# EAGLE design mkstepper23 (EAGLE 9.0.0)
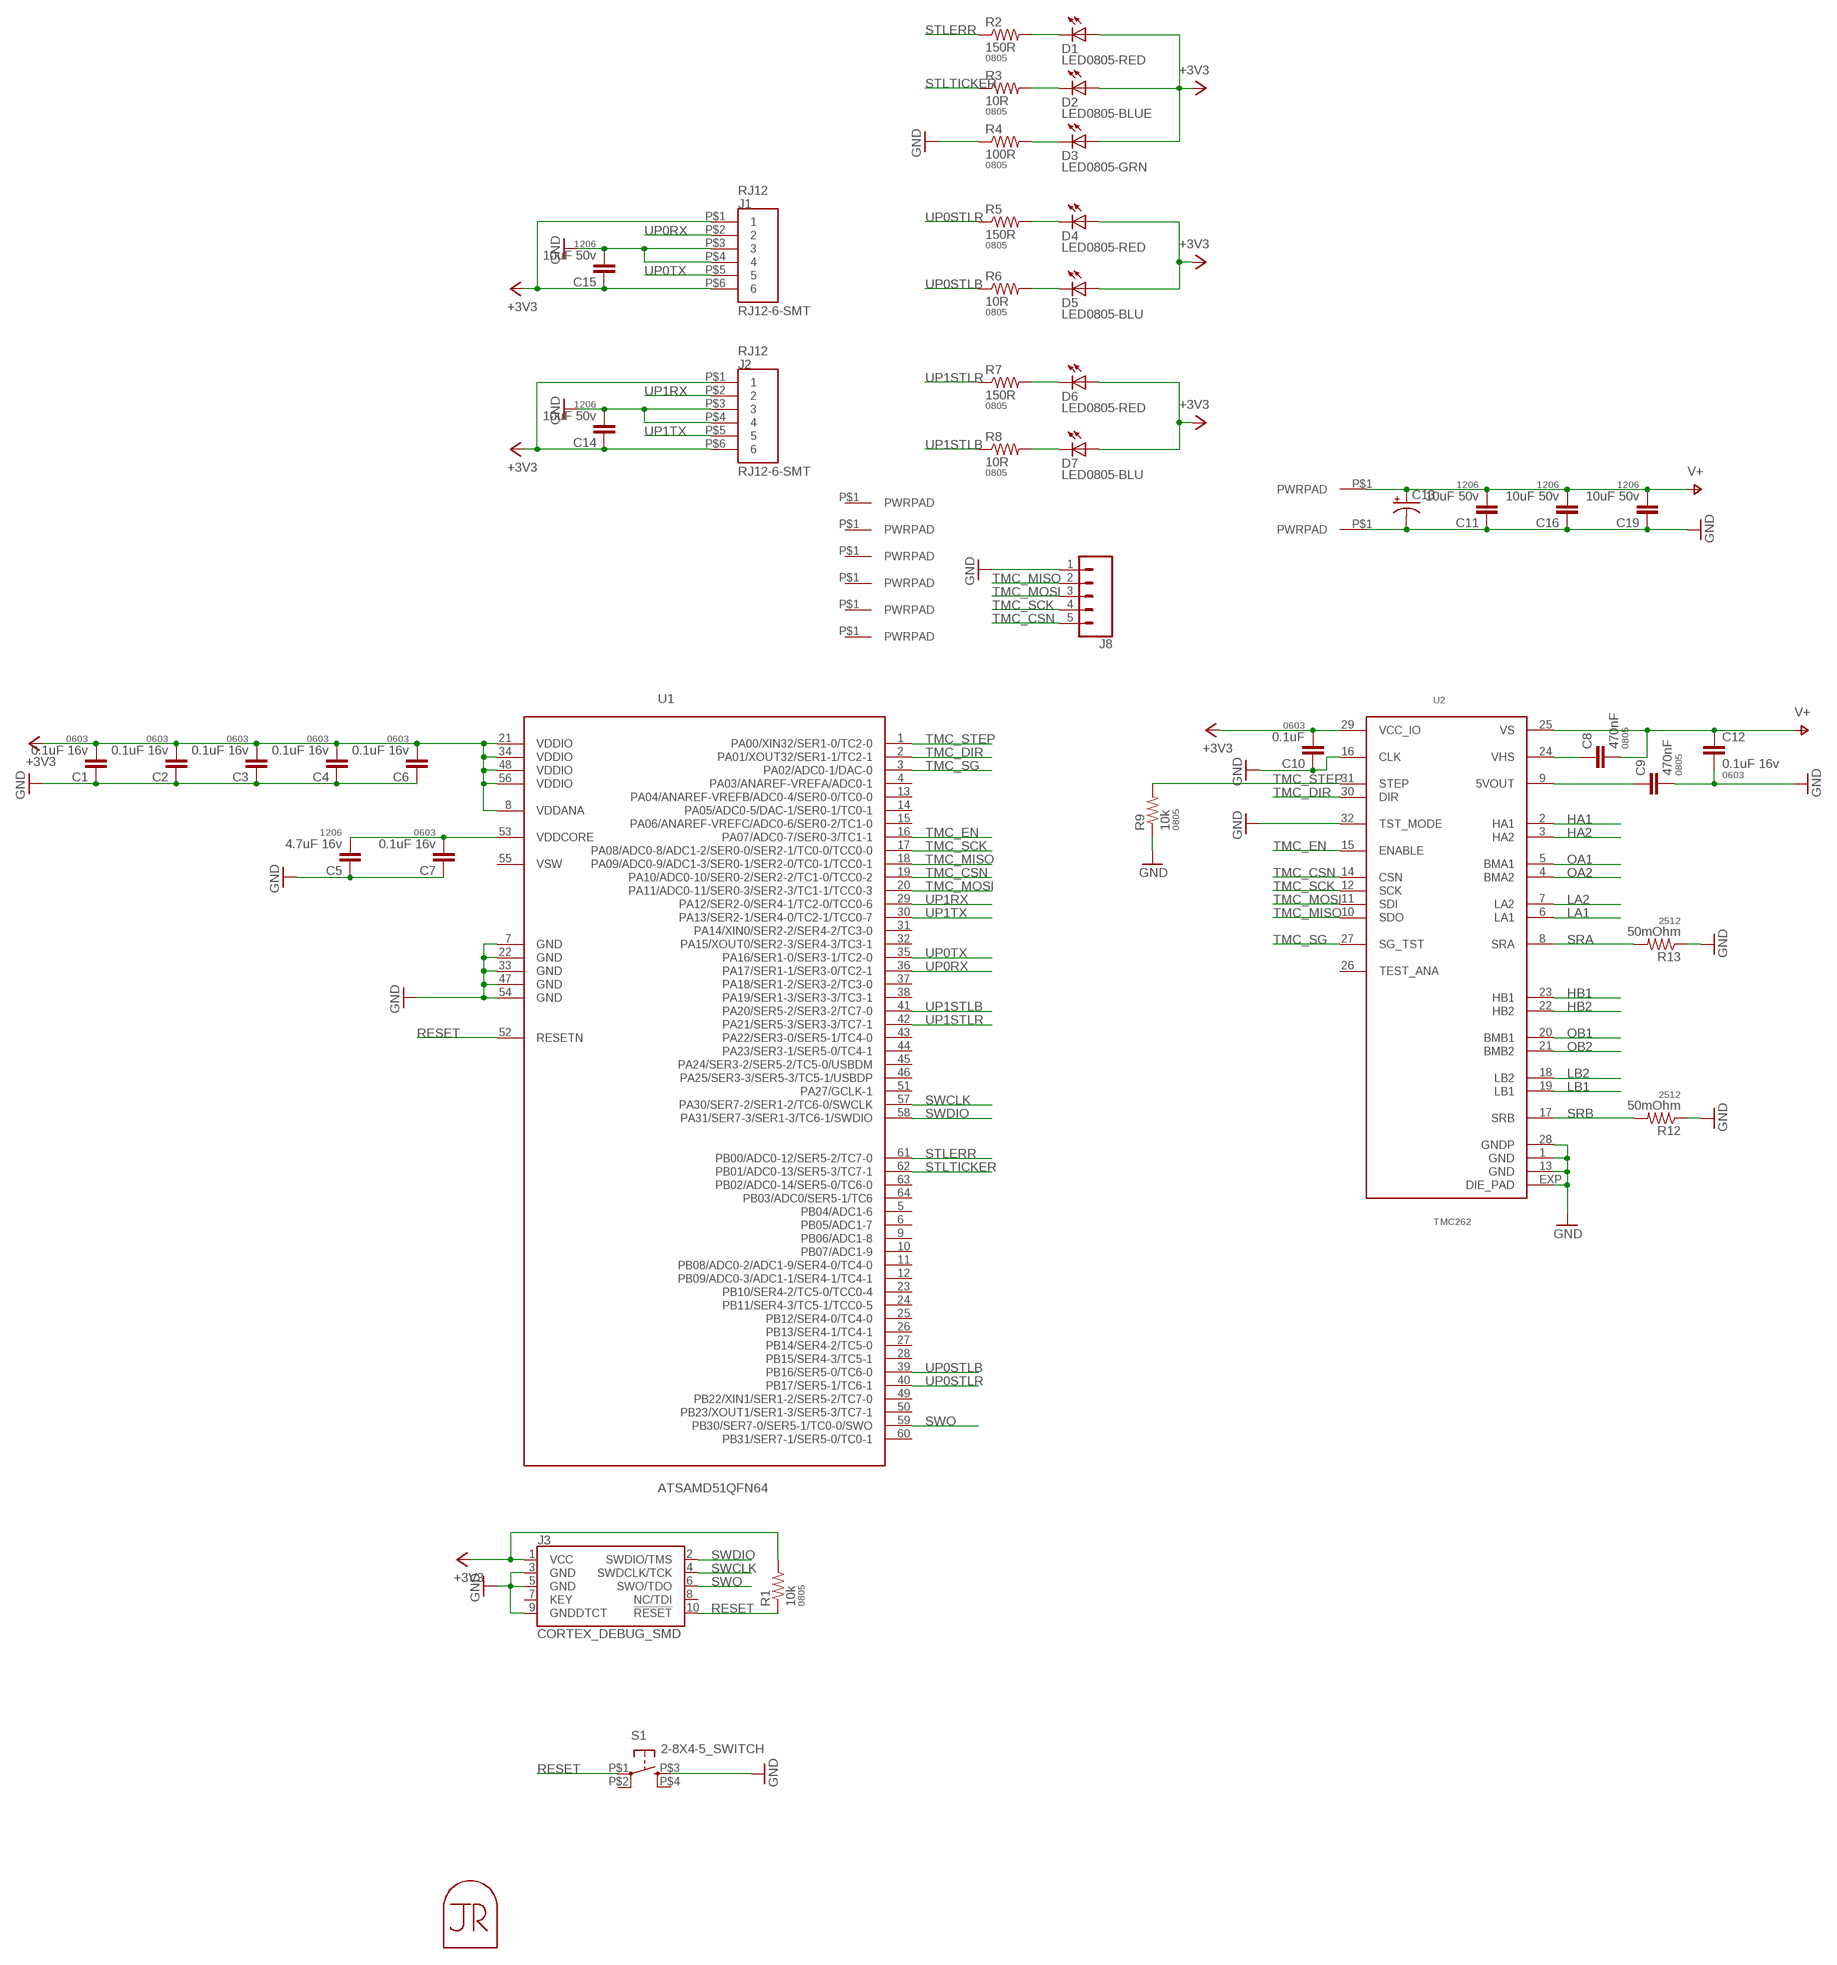
[diagram p0: schematic, sheet 1, part 1 of 2]
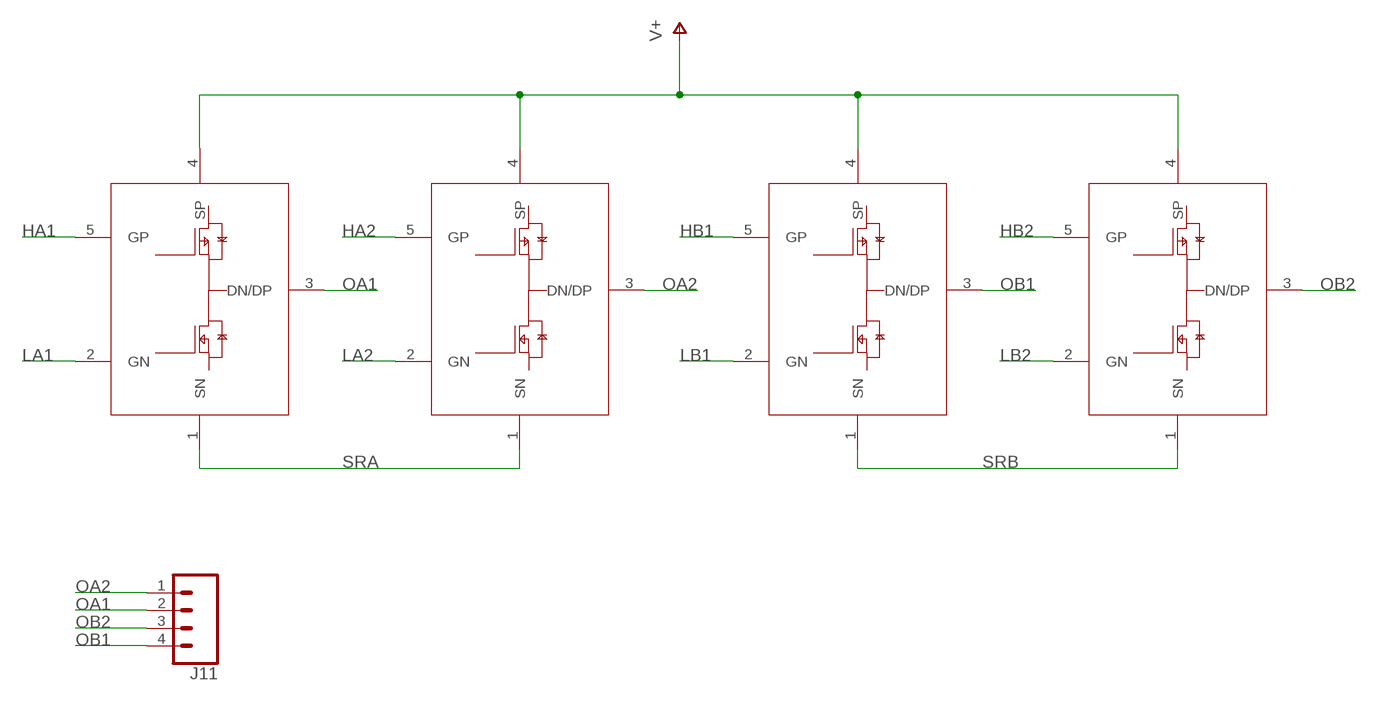
[diagram p1: schematic, sheet 1, part 2 of 2]

## Parts
C1  0.1uF 16v  CAP0603-CAP  [0603-CAP]
C2  0.1uF 16v  CAP0603-CAP  [0603-CAP]
C3  0.1uF 16v  CAP0603-CAP  [0603-CAP]
C4  0.1uF 16v  CAP0603-CAP  [0603-CAP]
C5  4.7uF 16v  CAP1206  [1206]
C6  0.1uF 16v  CAP0603-CAP  [0603-CAP]
C7  0.1uF 16v  CAP0603-CAP  [0603-CAP]
C8  470nF  CAP0805  [0805]
C9  470nF  CAP0805  [0805]
C10  0.1uF  CAP0603-CAP  [0603-CAP]
C11  10uF 50v  CAP1206  [1206]
C12  0.1uF 16v  CAP0603-CAP  [0603-CAP]
C13  CAP-POL-6.6X6.6  [6.6X6.6-CAP]
C14  10uF 50v  CAP1206  [1206]
C15  10uF 50v  CAP1206  [1206]
C16  10uF 50v  CAP1206  [1206]
C19  10uF 50v  CAP1206  [1206]
D1  LED0805-RED  LED0805  [LED0805]
D2  LED0805-BLUE  LED0805  [LED0805]
D3  LED0805-GRN  LED0805  [LED0805]
D4  LED0805-RED  LED0805  [LED0805]
D5  LED0805-BLU  LED0805  [LED0805]
D6  LED0805-RED  LED0805  [LED0805]
D7  LED0805-BLU  LED0805  [LED0805]
J1  RJ12-6-SMT  [RJ12-6-SMT]
J2  RJ12-6-SMT  [RJ12-6-SMT]
J3  CORTEX_DEBUG_SMD  [SAMTECH_FTSH-105-01]
J4  PWRPADM3-SKINNY  [PWRPAD_3-25MM-SKINNY]
J5  PWRPADM3-SKINNY  [PWRPAD_3-25MM-SKINNY]
J6  PWRPADM3-SKINNY  [PWRPAD_3-25MM-SKINNY]
J7  PWRPADM3-SKINNY  [PWRPAD_3-25MM-SKINNY]
J8  CONN_05NO_SILK  [1X05_NO_SILK]
J9  PWRPAD  [PWRPAD_M3-PEM-MOUNT]
J10  PWRPAD  [PWRPAD_M3-PEM-MOUNT]
J11  CONN_04LONGPADS  [1X04_LONGPADS]
J12  PWRPADM3-SKINNY  [PWRPAD_3-25MM-SKINNY]
J13  PWRPADM3-SKINNY  [PWRPAD_3-25MM-SKINNY]
MP1  JRTOMBSTONE  [JRTOMBSTONE]
Q1  PNPAIR-FDD8424H  [DPAK-5]
Q2  PNPAIR-FDD8424H  [DPAK-5]
Q3  PNPAIR-FDD8424H  [DPAK-5]
Q4  PNPAIR-FDD8424H  [DPAK-5]
R1  10k  RESISTOR0805-RES  [0805]
R2  150R  RESISTOR0805-RES  [0805]
R3  10R  RESISTOR0805-RES  [0805]
R4  100R  RESISTOR0805-RES  [0805]
R5  150R  RESISTOR0805-RES  [0805]
R6  10R  RESISTOR0805-RES  [0805]
R7  150R  RESISTOR0805-RES  [0805]
R8  10R  RESISTOR0805-RES  [0805]
R9  10k  RESISTOR0805-RES  [0805]
R12  50mOhm  RESISTOR2512  [R2512]
R13  50mOhm  RESISTOR2512  [R2512]
S1  2-8X4-5_SWITCH  [TACT-SWITCH-KMR6]
U1  ATSAMD51QFN64  [QFN-64-9X9MM]
U2  TMC262  [QFN32]

## Nets
+3V3: C1.2 C2.2 C3.2 C4.2 C6.2 C10.2 C14.1 C15.1 D1.1(A) D2.1(A) D3.1(A) D4.1(A) D5.1(A) D6.1(A) D7.1(A) J1.P$1 J1.P$6 J2.P$1 J2.P$6 J3.1(VCC) R1.2 U1.8(VDDANA) U1.21(VDDIO) U1.34(VDDIO) U1.48(VDDIO) U1.56(VDDIO) U2.29(VCC_IO)
GND: C1.1 C2.1 C3.1 C4.1 C5.1 C6.1 C7.1 C9.2 C10.1 C11.1 C12.2 C13.- C14.2 C15.2 C16.1 C19.1 J1.P$3 J1.P$4 J2.P$3 J2.P$4 J3.3(GND) J3.5(GND) J3.9(GNDDTCT) J8.1 J10.P$1(PWRPAD) R4.1 R9.1 R12.1 R13.1 S1.P$3(S) U1.7(GND) U1.22(GND) U1.33(GND) U1.47(GND) U1.54(GND) U2.1(GND) U2.13(GND) U2.16(CLK) U2.28(GNDP) U2.32(TST_MODE) U2.EXP(DIE_PAD)
HA1: Q1.5(GP) U2.2(HA1)
HA2: Q2.5(GP) U2.3(HA2)
HB1: Q3.5(GP) U2.23(HB1)
HB2: Q4.5(GP) U2.22(HB2)
LA1: Q1.2(GN) U2.6(LA1)
LA2: Q2.2(GN) U2.7(LA2)
LB1: Q3.2(GN) U2.19(LB1)
LB2: Q4.2(GN) U2.18(LB2)
N$1: D3.2(C) R4.2
N$2: C8.1 U2.24(VHS)
N$3: C9.1 U2.9(5VOUT)
N$5: D2.2(C) R3.2
N$6: D1.2(C) R2.2
N$7: C5.2 C7.2 U1.53(VDDCORE)
N$10: D4.2(C) R5.2
N$11: D5.2(C) R6.2
N$13: D6.2(C) R7.2
N$14: D7.2(C) R8.2
OA1: J11.2 Q1.3(DN/DP) U2.5(BMA1)
OA2: J11.1 Q2.3(DN/DP) U2.4(BMA2)
OB1: J11.4 Q3.3(DN/DP) U2.20(BMB1)
OB2: J11.3 Q4.3(DN/DP) U2.21(BMB2)
RESET: J3.10(!RESET) R1.1 S1.P$1(P) U1.52(RESETN)
SRA: Q1.1(SN) Q2.1(SN) R13.2 U2.8(SRA)
SRB: Q3.1(SN) Q4.1(SN) R12.2 U2.17(SRB)
STLERR: R2.1 U1.61(PB00/ADC0-12/SER5-2/TC7-0)
STLTICKER: R3.1 U1.62(PB01/ADC0-13/SER5-3/TC7-1)
SWCLK: J3.4(SWDCLK/TCK) U1.57(PA30/SER7-2/SER1-2/TC6-0/SWCLK)
SWDIO: J3.2(SWDIO/TMS) U1.58(PA31/SER7-3/SER1-3/TC6-1/SWDIO)
SWO: J3.6(SWO/TDO) U1.59(PB30/SER7-0/SER5-1/TC0-0/SWO)
TMC_CSN: J8.5 U1.19(PA10/ADC0-10/SER0-2/SER2-2/TC1-0/TCC0-2) U2.14(CSN)
TMC_DIR: U1.2(PA01/XOUT32/SER1-1/TC2-1) U2.30(DIR)
TMC_EN: U1.16(PA07/ADC0-7/SER0-3/TC1-1) U2.15(ENABLE)
TMC_MISO: J8.2 U1.18(PA09/ADC0-9/ADC1-3/SER0-1/SER2-0/TC0-1/TCC0-1) U2.10(SDO)
TMC_MOSI: J8.3 U1.20(PA11/ADC0-11/SER0-3/SER2-3/TC1-1/TCC0-3) U2.11(SDI)
TMC_SCK: J8.4 U1.17(PA08/ADC0-8/ADC1-2/SER0-0/SER2-1/TC0-0/TCC0-0) U2.12(SCK)
TMC_SG: U1.3(PA02/ADC0-1/DAC-0) U2.27(SG_TST)
TMC_STEP: R9.2 U1.1(PA00/XIN32/SER1-0/TC2-0) U2.31(STEP)
UP0RX: J1.P$2 U1.36(PA17/SER1-1/SER3-0/TC2-1)
UP0STLB: R6.1 U1.39(PB16/SER5-0/TC6-0)
UP0STLR: R5.1 U1.40(PB17/SER5-1/TC6-1)
UP0TX: J1.P$5 U1.35(PA16/SER1-0/SER3-1/TC2-0)
UP1RX: J2.P$2 U1.29(PA12/SER2-0/SER4-1/TC2-0/TCC0-6)
UP1STLB: R8.1 U1.41(PA20/SER5-2/SER3-2/TC7-0)
UP1STLR: R7.1 U1.42(PA21/SER5-3/SER3-3/TC7-1)
UP1TX: J2.P$5 U1.30(PA13/SER2-1/SER4-0/TC2-1/TCC0-7)
V+: C8.2 C11.2 C12.1 C13.+ C16.2 C19.2 J9.P$1(PWRPAD) Q1.4(SP) Q2.4(SP) Q3.4(SP) Q4.4(SP) U2.25(VS)
Unconnected: J3.7(KEY) J3.8(NC/TDI) J4.P$1(PWRPAD) J5.P$1(PWRPAD) J6.P$1(PWRPAD) J7.P$1(PWRPAD) J12.P$1(PWRPAD) J13.P$1(PWRPAD) S1.P$2(P1) S1.P$4(S1) U1.4(PA03/ANAREF-VREFA/ADC0-1) U1.5(PB04/ADC1-6) U1.6(PB05/ADC1-7) U1.9(PB06/ADC1-8) U1.10(PB07/ADC1-9) U1.11(PB08/ADC0-2/ADC1-9/SER4-0/TC4-0) U1.12(PB09/ADC0-3/ADC1-1/SER4-1/TC4-1) U1.13(PA04/ANAREF-VREFB/ADC0-4/SER0-0/TC0-0) U1.14(PA05/ADC0-5/DAC-1/SER0-1/TC0-1) U1.15(PA06/ANAREF-VREFC/ADC0-6/SER0-2/TC1-0) U1.23(PB10/SER4-2/TC5-0/TCC0-4) U1.24(PB11/SER4-3/TC5-1/TCC0-5) U1.25(PB12/SER4-0/TC4-0) U1.26(PB13/SER4-1/TC4-1) U1.27(PB14/SER4-2/TC5-0) U1.28(PB15/SER4-3/TC5-1) U1.31(PA14/XIN0/SER2-2/SER4-2/TC3-0) U1.32(PA15/XOUT0/SER2-3/SER4-3/TC3-1) U1.37(PA18/SER1-2/SER3-2/TC3-0) U1.38(PA19/SER1-3/SER3-3/TC3-1) U1.43(PA22/SER3-0/SER5-1/TC4-0) U1.44(PA23/SER3-1/SER5-0/TC4-1) U1.45(PA24/SER3-2/SER5-2/TC5-0/USBDM) U1.46(PA25/SER3-3/SER5-3/TC5-1/USBDP) U1.49(PB22/XIN1/SER1-2/SER5-2/TC7-0) U1.50(PB23/XOUT1/SER1-3/SER5-3/TC7-1) U1.51(PA27/GCLK-1) U1.55(VSW) U1.60(PB31/SER7-1/SER5-0/TC0-1) U1.63(PB02/ADC0-14/SER5-0/TC6-0) U1.64(PB03/ADC0/SER5-1/TC6) U2.26(TEST_ANA)

## Library data of the parts
C1-C4 C6 C7 C10 C12 = borkedlabs-passives:CAP: Capacitor Standard 0603 ceramic capacitor, and 0.1" leaded capacitor.; PACKAGE: 0603
C5 C11 C14-C16 C19 = borkedlabs-passives:CAP: Capacitor Standard 0603 ceramic capacitor, and 0.1" leaded capacitor.; PACKAGE: 1206
C8 C9 = borkedlabs-passives:CAP: Capacitor Standard 0603 ceramic capacitor, and 0.1" leaded capacitor.; PACKAGE: 0805
C13 = borkedlabs-passives:CAP-POL
D1-D7 = lights:LED: LED
J1 J2 = connector:RJ12-6-SMT
J3 = SparkFun-Connectors:CORTEX_DEBUG: Cortex Debug Connector - 10 pin Supports JTAG debug, Serial Wire debug, and Serial Wire Viewer. PTH and SMD connector options available. General Connector Information <http://infocenter.arm.com/help/topic/com.arm.doc.faqs/attached/13634/cortex_debug_connectors.pdf> Products: PTH Connector <http://www.digikey.com/product-detail/en/cnc-tech/3220-10-0100-00/1175-1627-ND/3883661> -via Digi-Key SparkFun PSoc <https://www.sparkfun.com/products/13229> SparkFun T <https://www.sparkfun.com/products/13810>
J4-J7 J9 J10 J12 J13 = power:PWRPAD
J8 = SparkFun-Connectors:CONN_05: Multi connection point. Often used as Generic Header-pin footprint for 0.1 inch spaced/style header connections On any of the 0.1 inch spaced packages, you can populate with these: Break Away Headers - Straight <https://www.sparkfun.com/products/116> (PRT-00116) Break Away Male Headers - Right Angle <https://www.sparkfun.com/products/553> (PRT-00553) Female Headers <https://www.sparkfun.com/products/115> (PRT-00115) Break Away Headers - Machine Pin <https://www.sparkfun.com/products/117> (PRT-00117) Break Away Female Headers - Swiss Machine Pin <https://www.sparkfun.com/products/743> (PRT-00743) For SCREWTERMINALS and SPRING TERMINALS visit here: Screw Terimnals on SparkFun.com <https://www.sparkfun.com/search/results?term=Screw+Terminals> (5mm/3.5mm/2.54mm spacing) This device is also useful as a general connection point to wire up your design to another part of your project. Our various solder wires solder well into these plated through hole pads. Hook-Up Wire - Assortment (Stranded, 22 AWG) <https://www.sparkfun.com/products/11375> (PRT-11375) Hook-Up Wire - Assortment (Solid Core, 22 AWG) <https://www.sparkfun.com/products/11367> (PRT-11367) View the entire wire category on our website here <https://www.sparkfun.com/categories/141> Special notes: Molex polarized connector foot print use with SKU : PRT-08231 with associated crimp pins and housings. 1MM SMD Version SKU: PRT-10208
J11 = SparkFun-Connectors:CONN_04: Multi connection point. Often used as Generic Header-pin footprint for 0.1 inch spaced/style header connections On any of the 0.1 inch spaced packages, you can populate with these: Break Away Headers - Straight <https://www.sparkfun.com/products/116> (PRT-00116) Break Away Male Headers - Right Angle <https://www.sparkfun.com/products/553> (PRT-00553) Female Headers <https://www.sparkfun.com/products/115> (PRT-00115) Break Away Headers - Machine Pin <https://www.sparkfun.com/products/117> (PRT-00117) Break Away Female Headers - Swiss Machine Pin <https://www.sparkfun.com/products/743> (PRT-00743) For SCREWTERMINALS and SPRING TERMINALS visit here: Screw Terimnals on SparkFun.com <https://www.sparkfun.com/search/results?term=Screw+Terminals> (5mm/3.5mm/2.54mm spacing) This device is also useful as a general connection point to wire up your design to another part of your project. Our various solder wires solder well into these plated through hole pads. Hook-Up Wire - Assortment (Stranded, 22 AWG) <https://www.sparkfun.com/products/11375> (PRT-11375) Hook-Up Wire - Assortment (Solid Core, 22 AWG) <https://www.sparkfun.com/products/11367> (PRT-11367) View the entire wire category on our website here <https://www.sparkfun.com/categories/141> Special notes: Molex polarized connector foot print use with SKU : PRT-08231 with associated crimp pins and housings. 1MM SMD Version SKU: PRT-10208; PROD_ID: CONN-09696
MP1 = connector:JRTOMBSTONE
Q1-Q4 = power:PNPAIR-FDD8424H
R1-R9 = borkedlabs-passives:RESISTOR: Resistor Basic schematic elements and footprints for 0603, 1206, and PTH resistors.; PACKAGE: 0805
R12 R13 = borkedlabs-passives:RESISTOR: Resistor Basic schematic elements and footprints for 0603, 1206, and PTH resistors.; PACKAGE: 2512
S1 = fab:2-8X4-5_SWITCH
U1 = atsam:ATSAMD51
U2 = power:TMC262

## Board
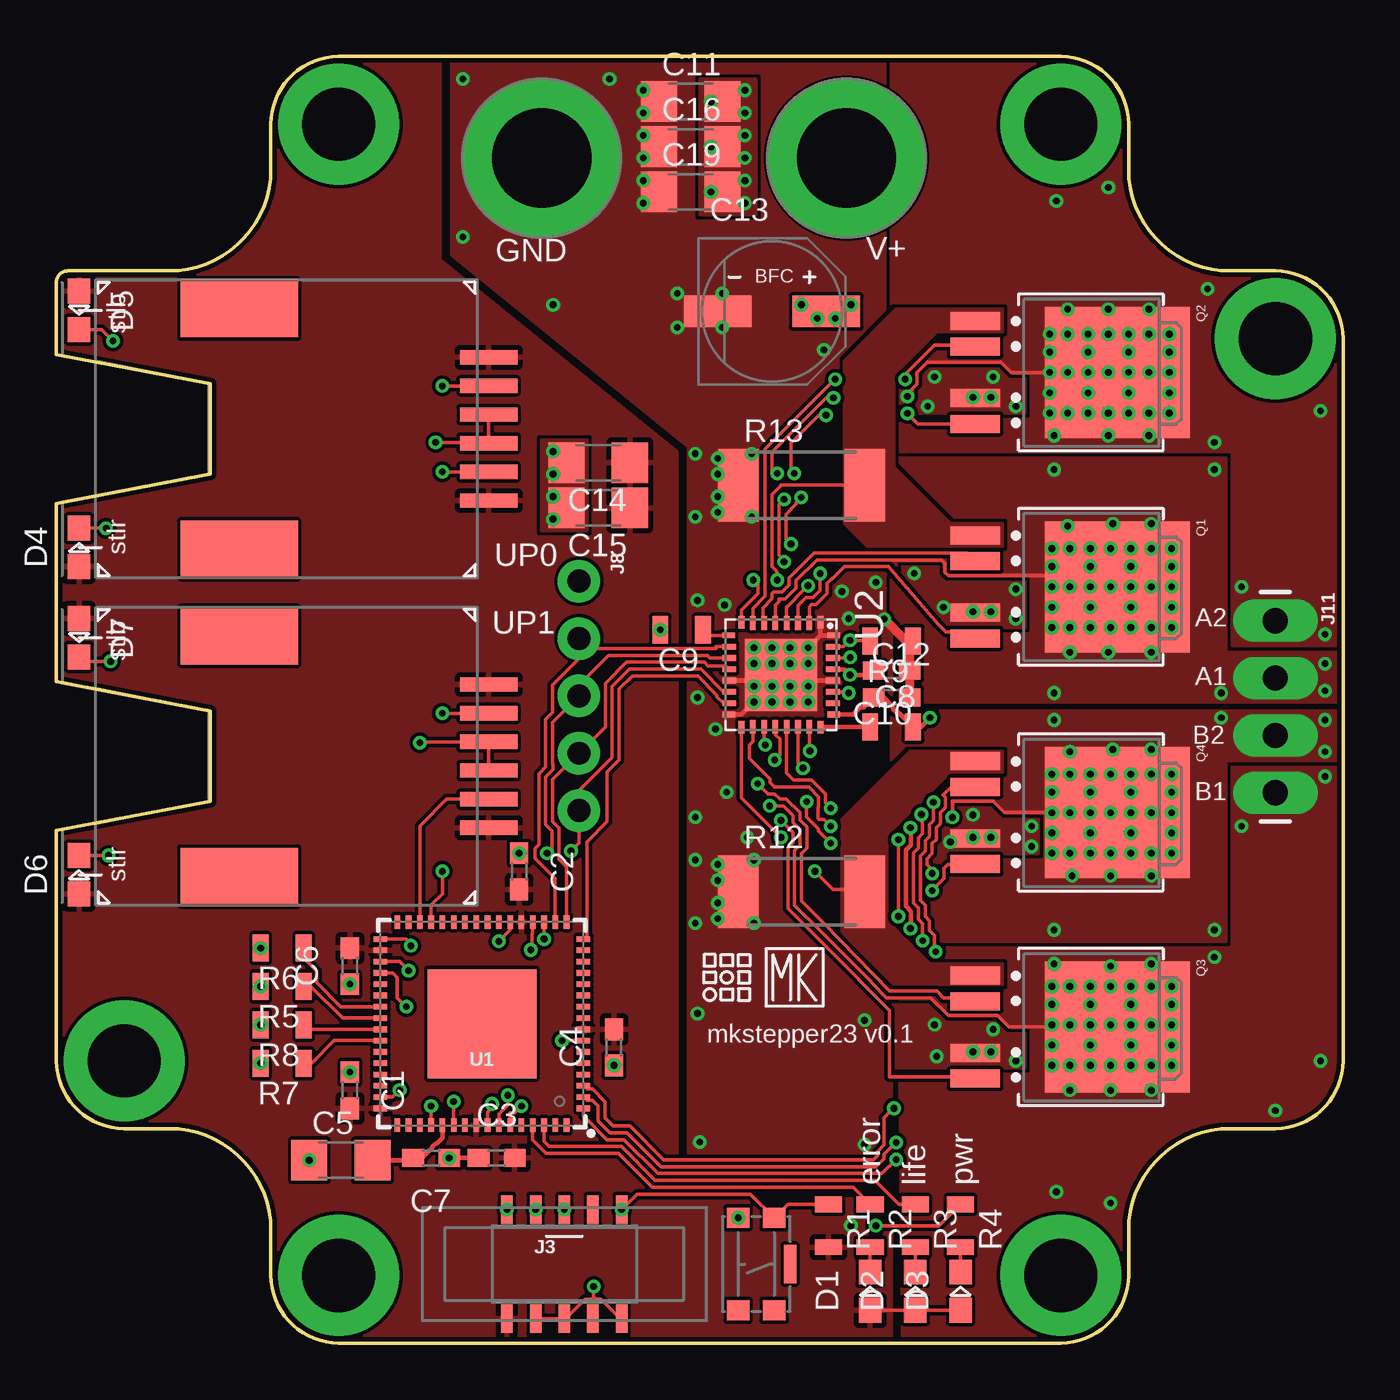
[diagram p2: board, top side]
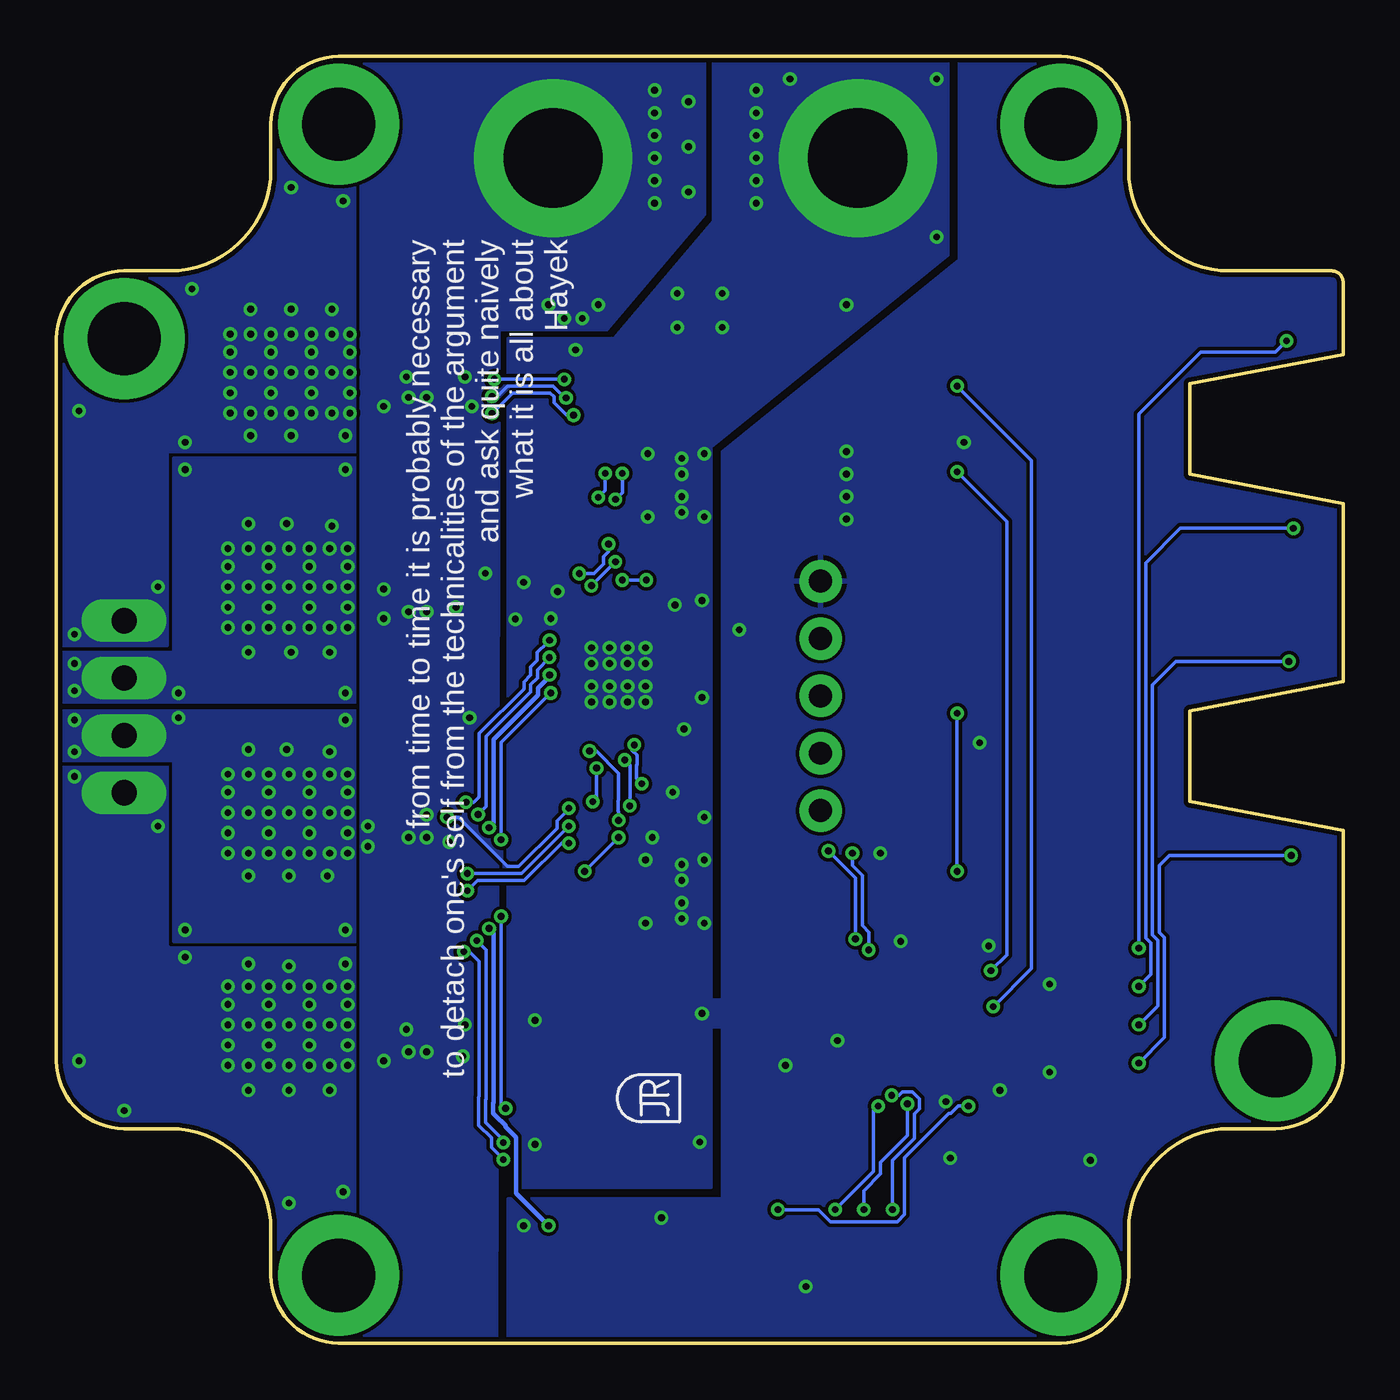
[diagram p3: board, bottom side, seen from below]

Size 57 x 57 mm. Coordinates in mm from the lower left corner, seen from the top.
Outline: 0.5,47.5 5,47.5 arc90 9.5,52 9.5,54 arc-90 12.5,57 44.5,57 arc-90 47.5,54 47.5,52 arc90 52,47.5 54,47.5 arc-90 57,44.5 57,12.5 arc-90 54,9.5 52,9.5 arc90 47.5,5 47.5,3 arc-90 44.5,0 12.5,0 arc-90 9.5,3 9.5,5 arc90 5,9.5 3,9.5 arc-90 0,12.5 0,22.7 6.8,24 6.8,28 0,29.3 0,37.2 6.8,38.5 6.8,42.5 0,43.8 0,47 arc-90 0.5,47.5
Copper layers (1*16): Top 0.035mm / dielectric 1.5mm / Bottom 0.035mm
Design rules "default *": minimum track width 6mil, minimum drill 0.3mm, track to track 6mil, track to pad 6mil, pad to pad 6mil, via to via 6mil, smd to smd 6mil, copper to edge 8mil, drill to drill 8mil, minimum pad ring 6mil, minimum via ring 6mil, stop-mask expansion 4mil, vias tented up to drill 27mil, thermal gap 9mil

### Footprints (pad centres in the part's own frame; a part is rotated, then mirrored left to right if it is on the bottom)
0603-CAP = smd 0.96 x 0.8: 1 -0.8,0; 2 0.8,0
1206 = smd 1.6 x 1.8: 1 -1.4,0; 2 1.4,0
0805 = smd 0.7 x 1.2: 1 -0.95,0; 2 0.95,0
6.6X6.6-CAP = smd 3 x 1.4: + 2.4,0; - -2.4,0
LED0805 = smd 1.1 x 1: 1 -0.85,0; 2 0.85,0
RJ12-6-SMT = smd 0.635 x 2.54: P$1 -3.175,17.399; P$2 -1.905,17.399; P$3 -0.635,17.399; P$4 0.635,17.399; P$5 1.905,17.399; P$6 3.175,17.399 | smd 2.54 x 5.207: P$7 -5.334,6.35; P$8 5.334,6.35
SAMTECH_FTSH-105-01 = smd 0.508 x 1.27: 1 -2.54,-2.413; 2 -2.54,2.413; 3 -1.27,-2.413; 4 -1.27,2.413; 5 0,-2.413; 6 0,2.413; 7 1.27,-2.413; 8 1.27,2.413; 9 2.54,-2.413; 10 2.54,2.413
PWRPAD_3-25MM-SKINNY = drill 3.25 pad 5.35: P$1 0,0
1X05_NO_SILK = drill 1.016 pad 1.88: 1 0,0; 2 2.54,0; 3 5.08,0; 4 7.62,0; 5 10.16,0
PWRPAD_M3-PEM-MOUNT = drill 4.4 pad 7: P$1 0,0
1X04_LONGPADS = drill 1.118 pad 1.88 long: 1 0,0; 2 2.54,0; 3 5.08,0; 4 7.62,0
DPAK-5 = smd 0.8 x 2.2: 1 -2.28,-5.3; 2 -1.14,-5.3; 4 1.14,-5.3; 5 2.28,-5.3 | smd 5.8 x 6.4: 3 0,1
R2512 = smd 1.8 x 3.2: 1 -2.8,0; 2 2.8,0
TACT-SWITCH-KMR6 = smd 0.9 x 1: P$1 -2.05,0.8; P$2 2.05,0.8; P$3 -2.05,-0.8; P$4 2.05,-0.8 | smd 1.7 x 0.55: P$5 0,1.5
QFN-64-9X9MM = smd 0.6 x 0.25: 1 -4.5,3.75; 2 -4.5,3.25; 3 -4.5,2.75; 4 -4.5,2.25; 5 -4.5,1.75; 6 -4.5,1.25; 7 -4.5,0.75; 8 -4.5,0.25; 9 -4.5,-0.25; 10 -4.5,-0.75; 11 -4.5,-1.25; 12 -4.5,-1.75; 13 -4.5,-2.25; 14 -4.5,-2.75; 15 -4.5,-3.25; 16 -4.5,-3.75; 33 4.5,-3.75; 34 4.5,-3.25; 35 4.5,-2.75; 36 4.5,-2.25; 37 4.5,-1.75; 38 4.5,-1.25; 39 4.5,-0.75; 40 4.5,-0.25; 41 4.5,0.25; 42 4.5,0.75; 43 4.5,1.25; 44 4.5,1.75; 45 4.5,2.25; 46 4.5,2.75; 47 4.5,3.25; 48 4.5,3.75 | smd 0.25 x 0.6: 17 -3.75,-4.5; 18 -3.25,-4.5; 19 -2.75,-4.5; 20 -2.25,-4.5; 21 -1.75,-4.5; 22 -1.25,-4.5; 23 -0.75,-4.5; 24 -0.25,-4.5; 25 0.25,-4.5; 26 0.75,-4.5; 27 1.25,-4.5; 28 1.75,-4.5; 29 2.25,-4.5; 30 2.75,-4.5; 31 3.25,-4.5; 32 3.75,-4.5; 49 3.75,4.5; 50 3.25,4.5; 51 2.75,4.5; 52 2.25,4.5; 53 1.75,4.5; 54 1.25,4.5; 55 0.75,4.5; 56 0.25,4.5; 57 -0.25,4.5; 58 -0.75,4.5; 59 -1.25,4.5; 60 -1.75,4.5; 61 -2.25,4.5; 62 -2.75,4.5; 63 -3.25,4.5; 64 -3.75,4.5 | smd 4.826 x 4.826: P$1 0,0
QFN32 = smd 0.55 x 0.25: 1 -2.325,1.75; 8 -2.325,-1.75; 17 2.325,-1.75; 24 2.325,1.75 | smd 0.6 x 0.25: 2 -2.3,1.25; 3 -2.3,0.75; 4 -2.3,0.25; 5 -2.3,-0.25; 6 -2.3,-0.75; 7 -2.3,-1.25; 18 2.3,-1.25; 19 2.3,-0.75; 20 2.3,-0.25; 21 2.3,0.25; 22 2.3,0.75; 23 2.3,1.25 | smd 0.25 x 0.55: 9 -1.75,-2.325; 16 1.75,-2.325; 25 1.75,2.325; 32 -1.75,2.325 | smd 0.25 x 0.6: 10 -1.25,-2.3; 11 -0.75,-2.3; 12 -0.25,-2.3; 13 0.25,-2.3; 14 0.75,-2.3; 15 1.25,-2.3; 26 1.25,2.3; 27 0.75,2.3; 28 0.25,2.3; 29 -0.25,2.3; 30 -0.75,2.3; 31 -1.25,2.3 | smd 3.2 x 3.2: EXP 0,0

### Placement (x,y rotation side)
C1  13,11.2 270 top
C2  20.5,20.9 270 top
C3  19.5,8.2 0 top
C4  24.7,13.1 90 top
C5  12.6,8.1 0 top
C6  13,16.7 90 top
C7  16.6,8.2 180 top
C8  37,27.3 0 top
C9  27.7,31.6 180 top
C10  37,29.8 180 top
C11  28.1,55 0 top
C12  37,28.6 0 top
C13  31.7,45.7 0 top
C14  24,39 180 top
C15  24,37 180 top
C16  28.1,53 0 top
C19  28.1,51 0 top
D1  36.05,2.3 90 top
D2  38.05,2.3 90 top
D3  40.05,2.3 90 top
D4  1,35.25 90 top
D5  1,45.75 270 top
D6  1,20.75 90 top
D7  1,31.25 270 top
J1  1.75,40.5 270 top
J2  1.75,26 270 top
J3  22.5,3.5 0 top
J4  44.5,54 0 top
J5  3,12.5 0 top
J6  12.5,54 0 top
J7  54,44.5 0 top
J8  23.15,33.75 270 top
J9  35,52.5 0 top
J10  21.5,52.5 0 top
J11  54,32 270 top
J12  44.5,3 0 top
J13  12.5,3 0 top
MP1  30.4,10.9 90 bottom
Q1  46,33.5 270 top
Q2  46,43 270 top
Q3  46,14 270 top
Q4  46,23.5 270 top
R1  34.2,5.2 270 top
R2  36.05,5.2 270 top
R3  38.05,5.2 270 top
R4  40.05,5.2 270 top
R5  10,15.8 180 top
R6  10,17.5 180 top
R7  10,12.4 180 top
R8  10,14.1 180 top
R9  37,31.1 180 top
R12  33,20 0 top
R13  33,38 0 top
S1  31,3.5 270 top
U1  18.85,14.15 180 top
U2  32.1,29.6 270 top
U$5  [CBA-SILK-LOGO]  29.7,16.2 90 top
U$9  [MK-LOGO-SILK]  32.7,16.2 0 top

### Tracks (layer width: path | path; a pad name or v marks a point on that pad's centre or on a via)
+3V3  (via drill 0.3)
  Top 0.152: D1.1 D2.1 D3.1
  Top 0.203: U2.29 34.91,29.85 v35.16,29.6 36,29.6 C10.2 | v37.84,22.84 37.84,22.55 37.86,22.53 37.86,22.07 37.63,21.84 37.63,19.36 37.86,19.13 37.86,18.67 37.84,18.65 v37.84,18.36
  Bottom 0.203: v35.16,29.6 35.16,29.53 35.66,29.03 35.66,28.71 37.63,26.74 37.63,23.04 v37.84,22.84 | v37.84,18.36 37.63,18.16 37.63,10.66 37.66,10.63 37.66,10.17 37.33,9.84 37.3,9.84 37.1,9.64 37.1,9.57 36.64,9.12 36.64,6.64 v35.2,5.2
  pour Top (rank 2): 37,-1 37,6.4 27.5,6.4 27.5,39.5 17,48 17,58 -0.8,57.8 -0.8,-1
GND  (via drill 0.3)
  Top 0.152: R4.1 39.1,5.2 v36.3,5.2 | J3.3 J3.5 22.56,1.09 23.42,1.95 23.9,1.95 | 23.9,1.95 24.12,1.95 24.98,1.09 J3.9 | 23.9,1.95 23.8,2.05 v23.8,2.5 | U1.33 15.5,17.9 15.7,17.7 v15.7,17.6 | U1.22 20.1,18.3 v19.6,17.8 | U1.47 14.9,10.9 v15.2,11.2 | U1.54 v17.6,10.7 | U1.7 v22.4,13.4 | J2.P$4 J2.P$3 16.14,26.64 v16.1,26.6 | J1.P$3 J1.P$4 19.11,39.9 v16.8,39.9
  Top 0.203: U2.1 33.85,31.35 | 33.85,31.35 v33.3,30.8 | U2.32 33.85,31.35 | U2.13 30.65,29.35 v30.9,29.1 | U2.16 30.35,27.85 v30.9,28.4 | U2.28 33.55,29.35 v33.3,29.1 | 37.88,31.02 R9.1 | C3.1 C7.1
  Top 0.406: C12.2 C10.1 37.8,30.95 37.88,31.02 | R9.1 37.64,31.1 v36.67,32.07
  other vias: 30.9,30.8 32.5,30.8 31.7,30.8 30.9,30.1 33.3,30.1 32.5,30.1 31.7,30.1 32.5,29.1 31.7,29.1 33.3,28.4 32.5,28.4 31.7,28.4 29.3,39.2 29.3,38.5 29.3,37.5 29.3,36.8 28.3,36.6 28.3,39.4 30.8,39.4 30.8,36.6 29.3,21.2 29.3,20.5 29.3,19.5 29.3,18.8 28.3,18.6 28.3,21.4 30.9,21.4 30.9,18.6 26.75,31.6 29.2,27.2 28.4,28.6 30.6,22.4 35.8,14.3 28.4,14.6 28.5,8.9 35.8,8.8 29.6,32.7 28.4,32.9 27.5,46.5 22,46 27.5,45 18,49 18,56 24.5,56 29.5,46.5 34,44 36.3,33.7 35.1,32.1 30.2,5.55 24.7,12.3 17.4,8.2 13,12 20.5,21.7 11.2,8.1 13,15.9 26,55.5 26,54.5 26,53.5 26,52.5 26,51.5 26,50.5 29.5,45 22,39.5 22,38.5 22,37.5 22,36.5 34.8,33.3 29.7,24.4 28.3,23.3
  pour Bottom: 27.9,57.5 27.9,49.7 32.3,44.5 37,44.5 37,6.9 28,6.9 28,39.7 17.5,48.2 17.5,57.5
  pour Top (no thermals): 31.2,21.7 28,21.7 28,18.3 31.2,18.3
  pour Top (no thermals): 31.2,39.7 28,39.7 28,36.3 31.2,36.3
  pour Bottom: 27.5,-0.6 37,-0.6 37,6.4 27.5,6.4 27.5,14 28.2,14 28.2,15.2 27.5,15.2 27.5,39.5 17,48 17,57.5 -0.5,57.5 -0.5,-0.5
  pour Top (rank 6, no thermals): 17.5,58 17.5,48.2 28,39.7 28,6.9 37,6.9 37,58
  pour Top (no thermals): 21.5,40 23.5,40 23.5,36 21.5,36
HA1
  Top 0.152: Q1.5 40.42,31.5 39.4,31.5 39.07,31.83 36.87,34.39 34.9,34.39 34.36,33.85 34.36,33.87 34.14,33.64 34.14,33.21 33.64,32.72 33.46,32.72 33.35,32.61 U2.2
HA2  (via drill 0.3)
  Top 0.152: Q2.5 38.17,40.72 v37.7,41.19 | v34.09,41.11 33.77,41.11 32.53,39.87 32.53,38.69 v32.69,38.53 | v32.99,37.47 32.77,37.24 32.77,37.16 32.31,36.71 32.31,35.63 v32.54,35.4 | v33.83,34.09 33.83,33.34 33.52,33.02 33.2,33.02 32.85,32.67 U2.3
  Bottom 0.152: v37.7,41.19 36.8,42.09 35.13,42.09 34.96,41.92 34.96,41.66 34.41,41.11 v34.09,41.11 | v32.69,38.53 32.69,37.77 v32.99,37.47 | v32.54,35.4 32.54,35.06 32.77,34.84 32.77,34.52 33.19,34.09 v33.83,34.09
HB1  (via drill 0.3)
  Top 0.152: Q3.5 40.62,11.8 36.9,11.8 36.9,14.73 36.56,15.07 36.46,15.17 35.55,16.08 35.55,16.11 32.4,19.26 32.4,21.95 | v32.09,23.16 32.63,22.62 32.63,22.18 32.4,21.95 | 32.4,21.95 | U2.23 33.35,26.26 v33.38,26.23
  Bottom 0.152: v32.09,23.16 32.09,23.54 32.13,23.58 32.13,24.02 32.09,24.06 32.09,25.25 33.08,26.23 v33.38,26.23
HB2  (via drill 0.3)
  Top 0.152: Q4.5 40.68,21.2 39.5,21.2 39.33,21.03 39.33,20.58 v38.8,20.05 v38.8,20.04 | v34.3,22.14 v34.3,22.15 33.77,22.68 33.77,22.77 33.24,23.31 v33.24,23.98 | v33.07,25.47 32.85,25.69 U2.22
  Bottom 0.152: v38.8,20.04 38.34,20.5 36.27,20.5 34.58,22.18 34.34,22.18 v34.3,22.14 | v33.07,25.47 33.07,24.15 v33.24,23.98
LA1
  Top 0.152: U2.6 31.3,31.95 31.3,32.57 31.7,32.97 31.7,33.2 31.77,33.27 32.15,33.27 32.46,33.58 32.46,33.9 33.56,35 40.34,35 Q1.2
LA2  (via drill 0.3)
  Top 0.152: Q2.2 39.6,44.2 38.9,44.2 37.6,42.9 v37.6,42.7 | v34.5,42.7 31.4,39.6 31.4,33.1 30.85,32.55 U2.7
  Bottom 0.152: v37.6,42.7 v34.5,42.7
LB1  (via drill 0.3)
  Top 0.152: Q3.2 40.54,15.3 39.3,15.3 39,15.6 36.9,15.6 34,18.6 33.01,19.59 33.01,21.7 33.24,21.93 33.24,22.87 32.93,23.18 32.93,23.5 32.33,24.11 32.05,24.11 31.82,24.33 31.52,24.33 v31.07,24.78 | U2.19 31.35,26.55 v31.4,26.5
  Bottom 0.152: v31.4,26.5 31.5,26.4 31.5,26.26 31.29,26.05 31.29,25.61 31.3,25.6 31.3,25.01 v31.07,24.78
LB2  (via drill 0.3)
  Top 0.152: Q4.2 39.64,24.64 39.28,24.28 39.39,24.18 39.39,23.74 39.16,23.51 39.16,23.03 38.98,22.84 38.98,22.31 38.8,22.13 38.8,21.68 38.57,21.45 38.57,21.2 38.8,20.97 v38.8,20.8 | U2.18 30.85,26.65 30.7,26.5 30.7,25.9 31.6,25 31.6,24.84 31.8,24.64 33.33,24.64 33.77,24.2 33.77,23.76 33.74,23.73 33.74,23.24 33.77,23.2 34,23.2 v34.3,22.9
  Bottom 0.152: v38.8,20.8 36.4,20.8 v34.3,22.9
N$1
  Top 0.152: D3.2 R4.2
N$2
  Top 0.203: U2.24 33.88,27.3 C8.1
N$3
  Top 0.152: U2.9 28.65,31.35 C9.1
N$5
  Top 0.152: D2.2 R3.2
N$6
  Top 0.152: D1.2 R2.2
N$7
  Top 0.203: U1.53 17.1,9.1 16.85,8.85 16.82,8.85 16.67,8.71 16.67,8.67 16.2,8.2 C7.2 15.7,8.1 C5.2
N$10  (via drill 0.3)
  Top 0.152: D4.2 v2.2,36.1
  Bottom 0.152: v2.2,36.1 7.2,36.1 8.74,34.55 8.74,17.95 8.52,17.72 8.52,16.33 R5.2
  other vias: 9.05,15.8
N$11  (via drill 0.3)
  Top 0.152: D5.2 2,44.9 v2.5,44.4
  Bottom 0.152: v2.5,44.4 3,43.9 6.3,43.9 9.05,41.15 R6.2
  other vias: 9.05,17.5
N$13  (via drill 0.3)
  Top 0.152: D6.2 v2.3,21.6
  Bottom 0.152: v2.3,21.6 7.7,21.6 8.14,21.16 8.14,18.2 7.91,17.97 7.91,13.54 R7.2
  other vias: 9.05,12.4
N$14  (via drill 0.3)
  Top 0.152: D7.2 1.2,30.2 v2.4,30.2
  Bottom 0.152: v2.4,30.2 7.4,30.2 8.44,29.16 8.44,18.07 8.21,17.85 8.21,14.94 R8.2
  other vias: 9.05,14.1
OA1  (via drill 0.3)
  Top 0.152: U2.5 31.85,32.69 32.01,32.85 32.01,32.96 32.28,32.96 32.77,33.45 32.77,33.77 33.69,34.7 39.2,34.7 39.37,34.52 39.37,34.15 39.51,34.01 46.49,34.01 Q1.3
  other vias: 49.4,35.2 49.4,34.4 49.4,33.5 49.4,32.6 49.4,31.7 44.1,35.2 44.1,34.4 44.1,33.5 44.1,32.6 44.1,31.7 44.9,35.2 44.8,36.2 44.9,33.5 44.9,30.6 44.9,31.7 45.8,35.2 45.8,34.4 45.8,33.5 45.8,32.6 45.8,31.7 46.7,35.2 46.8,36.3 46.7,33.5 46.6,30.6 46.7,31.7 47.6,35.2 47.6,34.4 47.6,33.5 47.6,32.6 47.6,31.7 48.5,35.2 48.5,36.3 48.5,33.5 48.5,30.6 48.5,31.7 44.2,28.8 51.6,28.8 56.2,28.9 56.2,30.1 51.3,38.7 44.2,38.7
  pour Top (rank 2, no thermals): 57.3,28.4 37,28.4 37,39.2 51.8,39.2 51.8,30.6 57.3,30.6
  pour Bottom (rank 2, no thermals): 57.3,28.4 37,28.4 37,39.2 51.8,39.2 51.8,30.6 57.3,30.6
OA2  (via drill 0.3)
  Top 0.152: Q2.3 42.3,43 41.84,43.46 38.59,43.46 38.13,43 38.13,42.48 37.7,42.05 v37.7,41.94 | v34.42,41.88 34.11,41.88 31.7,39.47 31.7,38.6 31.77,38.53 v31.93,38.53 | v32.24,37.38 32.01,37.15 32.01,34.9 32.24,34.67 v32.24,34.62 | U2.4 32.35,32.61 32.4,32.66 | 32.4,32.66 | 33.07,33.33 | 33.07,33.33 v33.3,33.55 | 32.4,32.66 33.07,33.33
  Bottom 0.152: v37.7,41.94 37.46,41.94 37.01,42.4 35,42.4 34.48,41.88 v34.42,41.88 | v31.93,38.53 31.93,37.69 v32.24,37.38 | v33.3,33.55 v32.24,34.62 | v32.24,34.62
  other vias: 49.3,44.7 49.3,43.9 49.3,43 49.3,42.1 49.3,41.2 44,44.7 44,43.9 44,43 44,42.1 44,41.2 44.8,44.7 44.8,45.8 44.8,43 51.3,39.9 44.8,41.2 45.7,44.7 45.7,43.9 45.7,43 45.7,42.1 45.7,41.2 46.6,44.7 46.6,45.8 46.6,43 46.6,40.2 46.6,41.2 47.5,44.7 47.5,43.9 47.5,43 47.5,42.1 47.5,41.2 48.4,44.7 48.4,45.8 48.4,43 48.4,40.2 48.4,41.2 56.2,31.4 52.5,33.5 56,41.3 51,46.7 44.2,40.2 44.3,50.6 46.6,51.2
  pour Top (rank 4, no thermals): 57.3,30.9 52.1,30.9 52.1,39.5 37,39.5 37,58.5 57.3,58.5
  pour Bottom (rank 4, no thermals): 57.3,30.9 52.1,30.9 52.1,39.5 37,39.5 37,58.1 57.3,58.1
OB1  (via drill 0.3)
  Top 0.152: Q3.3 42.2,14 41.69,14.51 39.51,14.51 38.72,15.3 37.02,15.3 37.02,15.29 36.9,15.3 36.77,15.3 36.68,15.39 36.59,15.47 36.59,15.48 35.95,16.15 33.8,18.29 | 33.8,18.29 33.8,18.3 | 33.8,18.29 32.7,19.39 32.7,21.82 32.94,22.05 32.94,22.75 32.62,23.06 32.62,23.38 32.2,23.8 v31.6,23.8 | U2.20 31.85,26.95 32.05,26.75 32.05,26.06 v31.82,25.83
  Bottom 0.152: v31.6,23.8 31.6,25.61 v31.82,25.83
  other vias: 49.4,15.8 49.4,15 49.4,14.1 49.4,13.2 49.4,12.3 44.1,15.8 44.1,15 44.1,14.1 44.1,13.2 44.1,12.3 44.9,15.8 44.9,14.1 44.9,11.2 44.9,12.3 45.8,15.8 45.8,15 45.8,14.1 45.8,13.2 45.8,12.3 46.7,15.8 46.7,16.7 46.7,14.1 46.7,11.2 46.7,12.3 47.6,15.8 47.6,15 47.6,14.1 47.6,13.2 47.6,12.3 48.5,15.8 48.5,16.8 48.5,14.1 48.5,11.2 48.5,12.3 56.2,25.1 52.5,22.9 51.3,17.1 56,12.5 54,10.3 44.2,16.8 44.3,6.7 46.7,6.2
  pour Top (rank 3, no thermals): 57.3,25.5 52,25.5 52,17.5 37.3,17.5 37.5,-1.3 57.5,-1.3
  pour Bottom (rank 3, no thermals): 57.3,25.5 52,25.5 52,17.5 37,17.5 37,-0.7 57.3,-0.7
OB2  (via drill 0.3)
  Top 0.152: Q4.3 42,23.5 41.49,24.01 39.7,24.01 v39.7,23.3 v39.69,23.29 | v34.3,23.7 34.07,23.93 34.07,24.33 33.46,24.94 32.66,24.94 32.35,25.25 U2.21
  Bottom 0.152: v39.69,23.29 39.19,23.29 37.01,21.11 36.53,21.11 34.83,22.8 34.83,23.12 34.3,23.65 v34.3,23.7
  other vias: 49.4,25.2 49.4,24.4 49.4,23.5 49.4,22.6 49.4,21.7 44.1,25.2 44.1,24.4 44.1,23.5 44.1,22.6 44.1,21.7 44.9,25.2 44.9,26.2 44.9,23.5 45,20.7 44.9,21.7 45.8,25.2 45.8,24.4 45.8,23.5 45.8,22.6 45.8,21.7 46.7,25.2 46.8,26.3 46.7,23.5 46.7,20.7 46.7,21.7 47.6,25.2 47.6,24.4 47.6,23.5 47.6,22.6 47.6,21.7 48.5,25.2 48.5,26.3 48.5,23.5 48.5,20.7 48.5,21.7 51.3,18.3 56.2,27.6 56.2,26.2 51.6,27.7 44.2,27.6 44.2,18.3
  pour Top (rank 2, no thermals): 57.3,28 37,28 37,17.8 51.8,17.8 51.8,25.8 57.3,25.8
  pour Bottom (rank 2, no thermals): 57.3,28 37,28 37,17.8 51.8,17.8 51.8,25.8 57.3,25.8
RESET  (via drill 0.3)
  Top 0.152: U1.52 v16.6,10.5 | R1.1 32.4,6.15 S1.P$1 30.76,6.6 25.72,6.6 J3.10
  Bottom 0.152: v16.6,10.5 17.05,10.5 17.38,10.17 17.46,10.17 19.43,8.2 19.43,5.69 19.74,5.38 22.72,5.38 23.25,5.91 J3.10
  other vias: 25.04,5.91
SRA  (via drill 0.3)
  Top 0.152: R13.2 32.1,38 32.1,37.99 31.7,37.6 31.7,34.4 31.93,34.17 v31.93,33.8 | U2.8 30.35,32.48 31.08,33.22 31.08,33.59 v30.87,33.8
  Bottom 0.152: v30.87,33.8 v31.93,33.8
  pour Top (no thermals): 41.9,44.8 39,44.8 37.1,42.9 37.1,38.8 39.6,36.3 41.9,36.3 41.9,35.3 35.9,35.3 34.9,36.3 34.9,43.5 37.2,45.8 41.9,45.8
SRB  (via drill 0.3)
  Top 0.152: R12.2 35.7,20.1 34.4,20.1 v33.6,20.9 | v32.1,22.4 30.35,24.15 U2.17
  Bottom 0.152: v33.6,20.9 v32.1,22.4
  pour Top (no thermals): 41.9,25.3 39.6,25.3 36.8,22.5 36.8,18.7 38.7,16.8 41.9,16.8 41.9,15.9 37.1,15.9 34.8,18.2 34.8,23.2 37.8,26.2 41.9,26.2
STLERR
  Top 0.152: R2.1 35.3,6.9 26.4,6.9 24.9,8.4 21.7,8.4 21.1,9 U1.61
STLTICKER
  Top 0.152: U1.62 21.6,8.93 21.83,8.71 25.03,8.71 26.53,7.21 36.27,7.21 37.32,6.15 R3.1
SWCLK  (via drill 0.3)
  Top 0.152: v19.3,10.6 19.1,10.2 U1.57
  Bottom 0.152: J3.4 21.23,6.75 20.5,7.49 20.5,8 19.3,9.2 v19.3,10.6
  other vias: 21.23,5.91
SWDIO  (via drill 0.3)
  Top 0.152: U1.58 19.6,10.15 20,10.55 v20,10.97
  Bottom 0.152: v20,10.97 19.68,10.97 19.52,11.13 19.08,11.13 18.77,10.82 18.77,10.38 19,10.15 19,9.07 19.96,8.1 J3.2
  other vias: 19.96,5.91
SWO  (via drill 0.3)
  Top 0.152: U1.59 20.1,10.2 20.3,10.2 v20.6,10.5
  Bottom 0.152: v20.6,10.5 20.8,10.3 20.8,7.61 J3.6
  other vias: 22.5,5.91
TMC_CSN  (via drill 0.3)
  Top 0.152: U2.14 29.55,28.85 28.55,29.86 25.39,29.86 24.62,29.09 24.62,25.95 23.15,24.48 J8.5 23.15,22.15 v22.8,21.8 | v21.6,17.9 U1.19
  Bottom 0.152: v22.8,21.8 21.6,20.6 v21.6,17.9
TMC_DIR  (via drill 0.3)
  Top 0.152: U2.30 35.14,30.35 v35.16,30.38 | v38.32,23.42 38.32,23.1 38.37,23.05 38.37,22.57 38.19,22.39 38.19,21.93 37.96,21.71 37.96,19.49 38.19,19.27 38.19,18.76 38.37,18.59 v38.37,17.83 | U1.2 23.5,10.75 23.75,10.75 24,10.5 24,9.84 24.53,9.31 25.28,9.31 26.78,7.81 36.31,7.81 36.67,8.17 36.67,8.36 v37.2,8.89
  Bottom 0.152: v35.16,30.38 35.16,30.34 35.69,29.82 35.69,29.47 35.99,29.17 35.99,28.85 37.96,26.87 37.96,23.78 v38.32,23.42 | v38.37,17.83 37.96,17.42 37.96,10.79 37.99,10.77 37.99,9.78 37.2,8.99 v37.2,8.89
TMC_EN
  Top 0.152: U2.15 29.55,28.35 29.27,28.63 29.27,28.7 28.42,29.55 25.51,29.55 24.93,28.97 24.93,25.82 24.4,25.3 24.4,23.1 23.5,22.2 23.5,18.05 U1.16
TMC_MISO
  Top 0.152: U2.10 29.23,30.85 29.23,30.77 23.59,30.77 J8.2 23.15,30.32 21.98,29.15 21.98,27.93 21.68,27.63 21.68,25.52 21.37,25.21 21.37,22.09 21.21,21.92 21.21,21.48 22.1,20.59 U1.18
TMC_MOSI  (via drill 0.3)
  Top 0.152: U2.11 28.95,30.35 28.83,30.47 24.47,30.47 23.15,29.15 J8.3 21.98,27.5 21.98,25.65 22,25.63 22,25.41 21.68,25.09 21.68,22.98 21.96,22.69 21.96,21.7 v21.74,21.7 | v21.02,17.41 21.1,17.5 21.1,17.65 21.07,17.68 21.07,18.12 21.1,18.15 U1.20
  Bottom 0.152: v21.74,21.7 21.74,21.17 21.3,20.73 21.3,18.5 21,18.2 21,17.43 v21.02,17.41
TMC_SCK
  Top 0.152: U2.12 29.65,30 28.87,30 28.71,30.16 25.26,30.16 24.32,29.22 24.32,27.3 J8.4 21.98,24.96 21.98,23.11 22.27,22.82 22.27,21.43 22.6,21.1 U1.17
TMC_SG  (via drill 0.3)
  Top 0.152: U2.27 35.05,28.85 v35.1,28.8 | v37.3,22.3 v37.3,18.9 | v37.1,10.4 36.67,9.97 36.67,8.79 36.36,8.48 36.36,8.29 36.19,8.12 26.91,8.12 25.41,9.62 24.65,9.62 24.3,9.97 24.3,10.69 23.75,11.25 23.5,11.25 U1.3
  Bottom 0.152: v35.1,28.8 37.3,26.6 v37.3,22.3 | v37.3,18.9 37.3,10.6 v37.1,10.4
TMC_STEP  (via drill 0.3)
  Top 0.152: U2.31 34.87,30.85 v35.16,31.13 36.05,31.13 R9.2 | v38.86,23.96 38.86,23.16 38.67,22.97 38.67,22.44 38.49,22.26 38.49,21.81 38.27,21.58 38.27,19.62 38.49,19.39 38.49,18.89 38.67,18.71 38.67,18.28 38.9,18.05 38.9,17.4 v38.96,17.34 | v37.2,8.13 36.58,7.51 26.65,7.51 25.15,9.01 24.4,9.01 23.35,10.06 U1.1
  Bottom 0.152: v35.16,31.13 35.38,30.91 35.59,30.7 35.6,30.7 35.7,30.6 35.7,30.24 35.99,29.95 35.99,29.59 36.29,29.29 36.29,28.97 38.27,27 38.27,24.2 38.51,23.96 v38.86,23.96 | v38.96,17.34 38.71,17.34 38.27,16.9 38.27,10.92 38.29,10.89 38.29,9.65 37.73,9.09 37.73,8.67 v37.2,8.13
UP0RX  (via drill 0.3)
  Top 0.152: J1.P$2 v17.11,42.41 v17.1,42.4 | v15.5,14.9 15.1,15.3 15.1,16.2 14.9,16.4 U1.36
  Bottom 0.152: v17.1,42.4 13.8,39.1 13.8,16.6 v15.5,14.9
UP0STLB
  Top 0.152: U1.39 12.6,14.9 11.53,15.97 11.53,16.5 10.95,17.07 R6.1
UP0STLR
  Top 0.152: R5.1 11.27,15.8 12.67,14.4 U1.40
UP0TX  (via drill 0.3)
  Top 0.152: J1.P$5 v17.11,38.59 v17.1,38.6 | v15.6,16.5 15.2,16.9 U1.35
  Bottom 0.152: v17.1,38.6 14.9,36.4 14.9,17.2 v15.6,16.5
UP1RX  (via drill 0.3)
  Top 0.152: J2.P$2 v17.1,27.9 | U1.29 16.6,19.4 17.1,19.9 v17.1,20.9
  Bottom 0.152: v17.1,27.9 v17.1,20.9
UP1STLB
  Top 0.152: R8.1 11.15,13.9 U1.41
UP1STLR
  Top 0.152: R7.1 11.3,12.4 12.3,13.4 U1.42
UP1TX
  Top 0.152: J2.P$5 17.3,24.09 16.1,22.9 U1.30
V+  (via drill 0.3)
  Top 0.152: v34.5,45.4 34.4,45.4 C13.+
  Top 0.203: U2.25 35.29,27.85 35.59,28.15 35.75,28.15 C12.1 36.65,28.6 37.07,28.18 37.07,28.09 37.22,27.95 37.3,27.95 C8.2 38.3,27.3 v38.7,27.7
  other vias: 41.4,41.9 41.4,32.4 41.4,22.4 41.4,12.9 40.6,41.9 41.5,42.8 38.9,42.8 38.6,41.5 42.5,41.5 40.6,32.4 42.5,32.1 42.5,33.4 38,34.1 39.3,32.6 40.6,23.4 43.2,22.9 40.6,22.4 43.2,22 39.6,22.2 40.6,12.9 42.5,12.5 41.5,13.9 38.9,14.1 39,12.7 33,46 35.2,46 33.7,45.4 30.5,50.5 30.5,51.5 30.5,52.5 30.5,53.5 30.5,54.5 30.5,55.5 29,55 29,53 29,51
  pour Bottom: 43.5,57.5 28.3,57.5 28.3,50 32.6,44.9 37.4,44.9 37.5,-0.5 43.5,-0.5
  pour Top (rank 2, no thermals): 37,41.2 42.9,41.2 42.9,43.5 37,43.5
  pour Top (no thermals): 39.6,31.7 42.9,31.7 42.9,34.1 42.9,34.7 37.5,34.7 37.5,31.7
  pour Top (no thermals): 39.6,21.7 43.5,21.7 43.5,23.5 42.1,23.5 41.6,24 39.5,24 38.6,23.1 38.6,21.3 39.5,21.3 39.6,21.4
  pour Top (no thermals): 36.9,12.2 42.9,12.2 42.9,15.4 36.9,15.4
  pour Top (no thermals): 28.5,56 31,56 31,50 28.5,50

### Text on the board
tPlace: V+ | GND | UP0 | A2 | UP1 | A1 | B2 | B1 | mkstepper23 v0.1 | error | life | pwr
bPlace: from time to time it is probably necessary / to detach one's self from the technicalities of the argument / and ask quite naively / what it is all about / Hayek